# Altium schematic sheet S7CAS-PLEIADES-CARTE-MERE_P02_FPGA_B0B1.SchDoc
size Tabloid; DocumentNumber: 5; SheetNumber: 5; SheetTotal: 14; Size: 11x17; Sheet_Name: FPGA Bank0-1
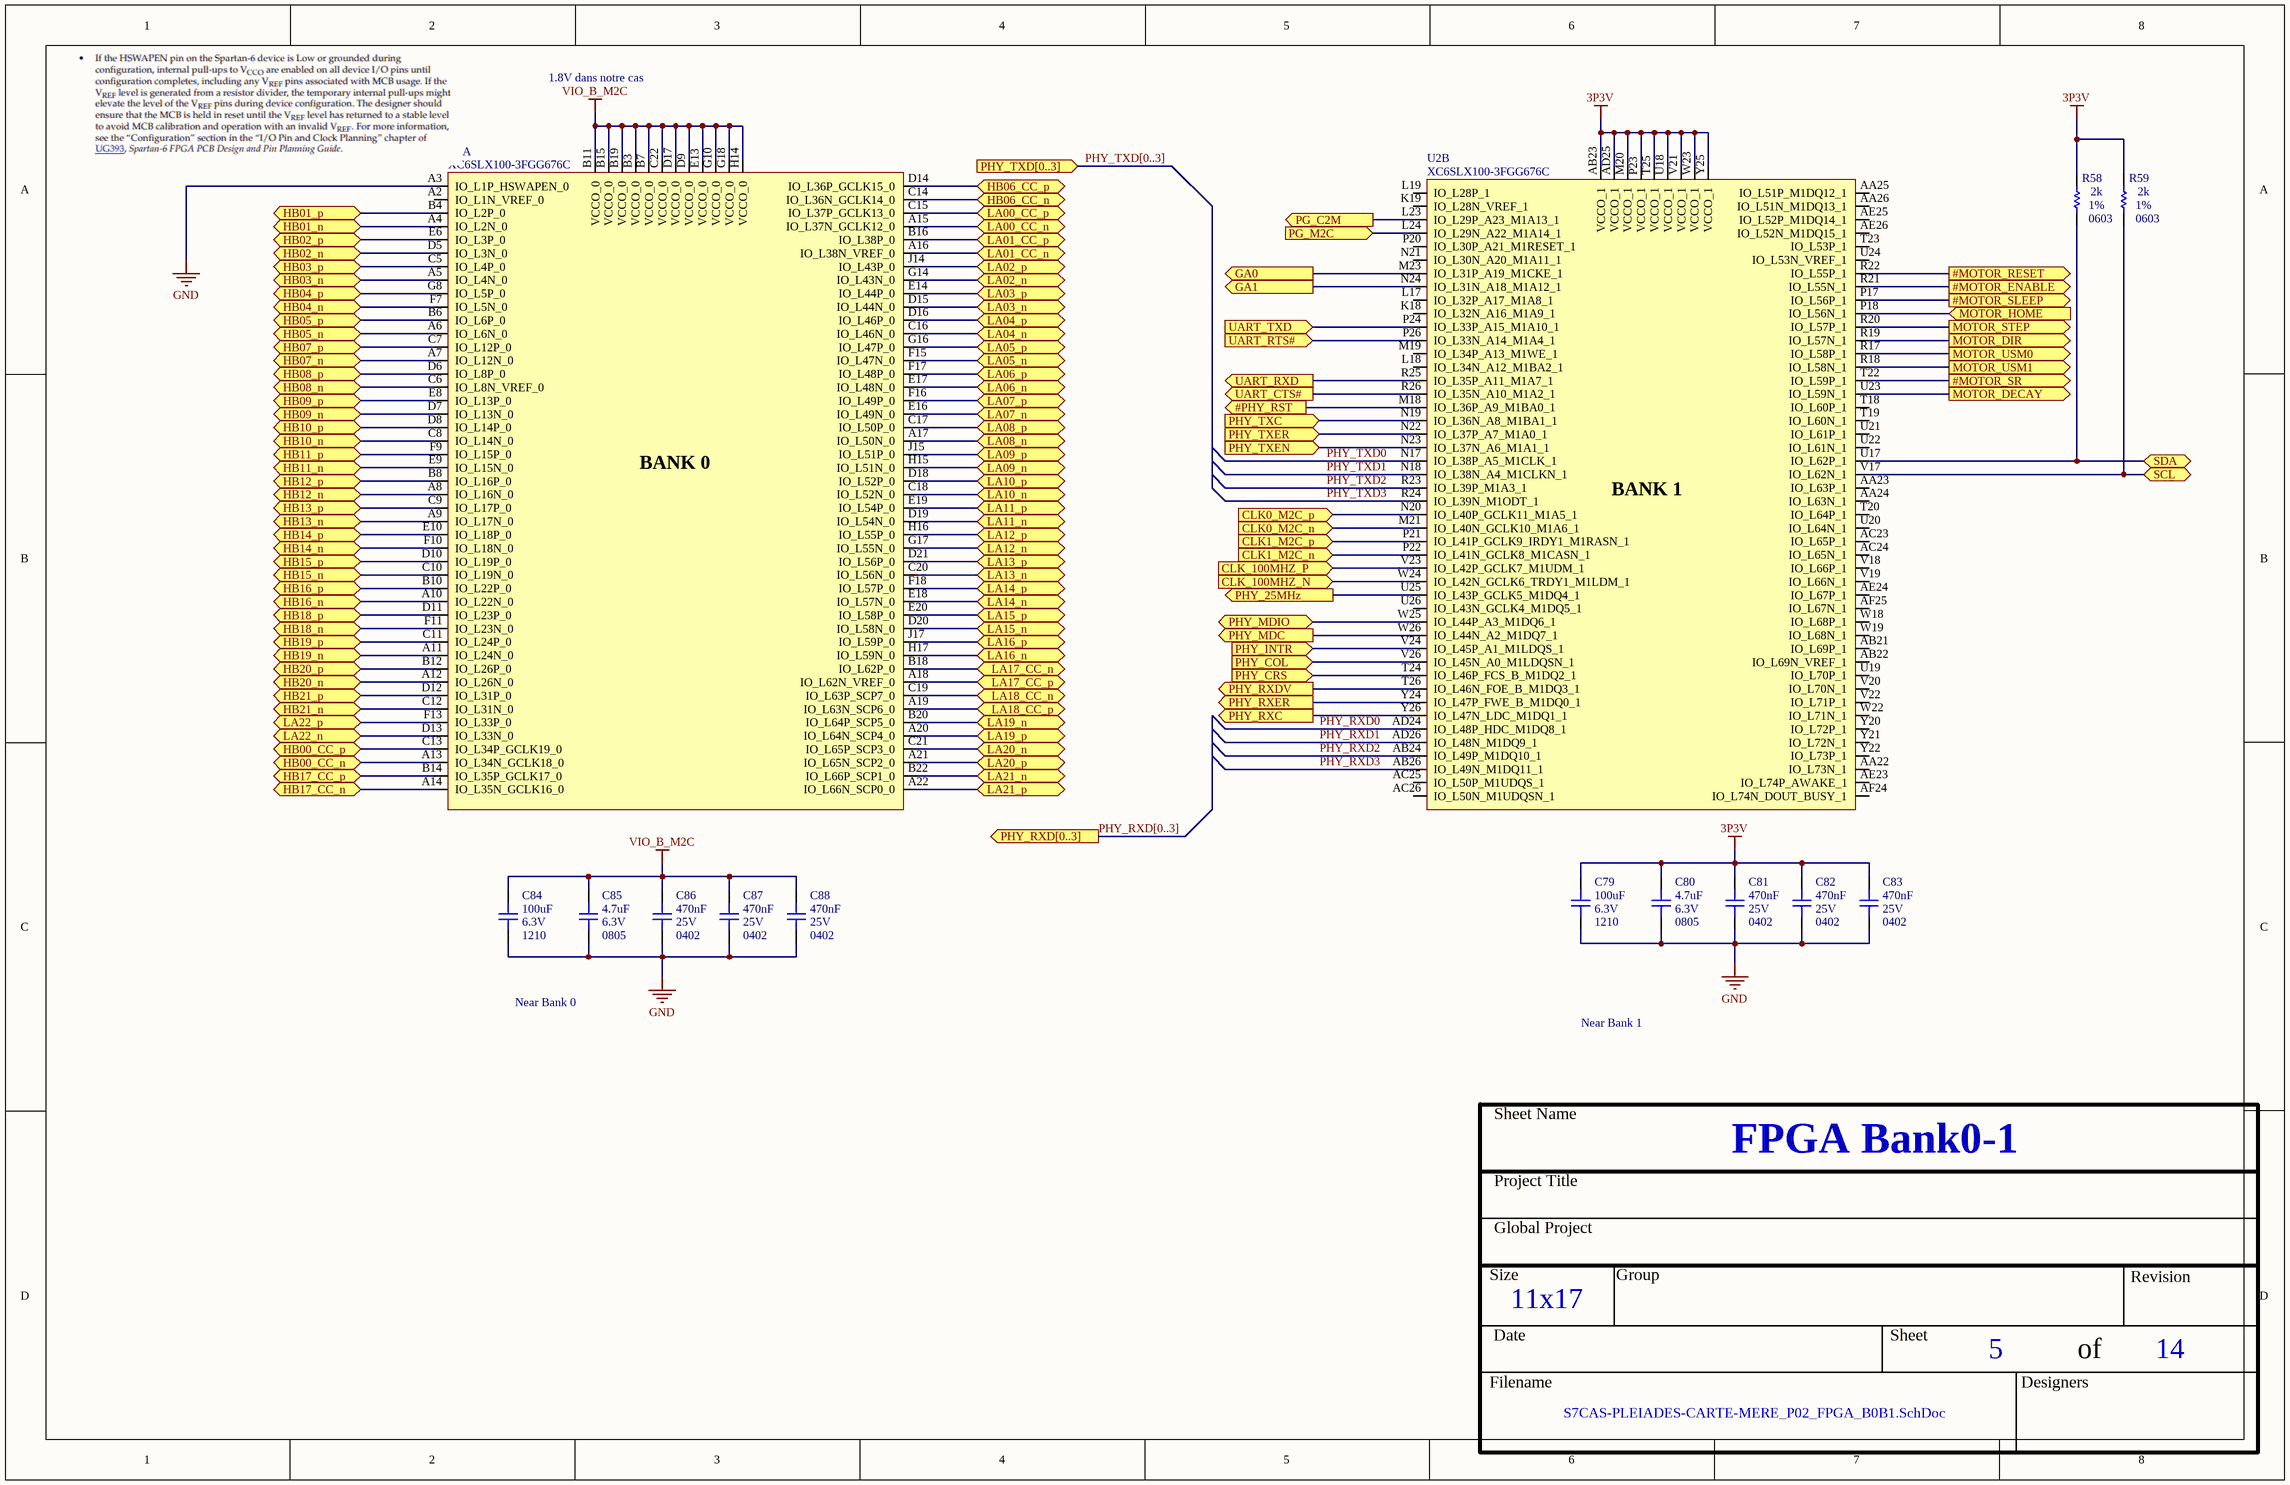
[diagram p0: S7CAS-PLEIADES-CARTE-MERE_P02_FPGA_B0B1.SchDoc]

## Parts
C79  value 100uF  Voltage: 6.3V  Package: 1210  [CAP_1210]  (hidden comment: CAP - 1210)
C80  value 4.7uF  Voltage: 6.3V  Package: 0805  [CAP_0805]  (hidden comment: CAP - 0805)
C81  value 470nF  Voltage: 25V  Package: 0402  [CAP_0402]  (hidden comment: CAP - 0402)
C82  value 470nF  Voltage: 25V  Package: 0402  [CAP_0402]  (hidden comment: CAP - 0402)
C83  value 470nF  Voltage: 25V  Package: 0402  [CAP_0402]  (hidden comment: CAP - 0402)
C84  value 100uF  Voltage: 6.3V  Package: 1210  [CAP_1210]  (hidden comment: CAP - 1210)
C85  value 4.7uF  Voltage: 6.3V  Package: 0805  [CAP_0805]  (hidden comment: CAP - 0805)
C86  value 470nF  Voltage: 25V  Package: 0402  [CAP_0402]  (hidden comment: CAP - 0402)
C87  value 470nF  Voltage: 25V  Package: 0402  [CAP_0402]  (hidden comment: CAP - 0402)
C88  value 470nF  Voltage: 25V  Package: 0402  [CAP_0402]  (hidden comment: CAP - 0402)
R58  value 2k  Package: 0603  Precision: 1%  [RES_0603]  (hidden comment: RES - 0603)
R59  value 2k  Package: 0603  Precision: 1%  [RES_0603]  (hidden comment: RES - 0603)
U2  XC6SLX100-3FGG676C  [FPGA_XILINX_FGG676]  (parts A,B of 10)

## Ports
#MOTOR_ENABLE (out), #MOTOR_RESET (out), #MOTOR_SLEEP (out), #MOTOR_SR (out), #PHY_RST (out), CLK0_M2C_n (in), CLK0_M2C_p (in), CLK1_M2C_n (in), CLK1_M2C_p (in), CLK_100MHZ_N (in), CLK_100MHZ_P (in), GA0 (out), GA1 (out), HB00_CC_n (bidir), HB00_CC_p (bidir), HB01_n (bidir), HB01_p (bidir), HB02_n (bidir), HB02_p (bidir), HB03_n (bidir), HB03_p (bidir), HB04_n (bidir), HB04_p (bidir), HB05_n (bidir), HB05_p (bidir), HB06_CC_n (bidir), HB06_CC_p (bidir), HB07_n (bidir), HB07_p (bidir), HB08_n (bidir), HB08_p (bidir), HB09_n (bidir), HB09_p (bidir), HB10_n (bidir), HB10_p (bidir), HB11_n (bidir), HB11_p (bidir), HB12_n (bidir), HB12_p (bidir), HB13_n (bidir), HB13_p (bidir), HB14_n (bidir), HB14_p (bidir), HB15_n (bidir), HB15_p (bidir), HB16_n (bidir), HB16_p (bidir), HB17_CC_n (bidir), HB17_CC_p (bidir), HB18_n (bidir), HB18_p (bidir), HB19_n (bidir), HB19_p (bidir), HB20_n (bidir), HB20_p (bidir), HB21_n (bidir), HB21_p (bidir), LA00_CC_n (bidir), LA00_CC_p (bidir), LA01_CC_n (bidir), LA01_CC_p (bidir), LA02_n (bidir), LA02_p (bidir), LA03_n (bidir), LA03_p (bidir), LA04_n (bidir), LA04_p (bidir), LA05_n (bidir), LA05_p (bidir), LA06_n (bidir), LA06_p (bidir), LA07_n (bidir), LA07_p (bidir), LA08_n (bidir), LA08_p (bidir), LA09_n (bidir), LA09_p (bidir), LA10_n (bidir), LA10_p (bidir), LA11_n (bidir), LA11_p (bidir), LA12_n (bidir), LA12_p (bidir), LA13_n (bidir), LA13_p (bidir), LA14_n (bidir), LA14_p (bidir), LA15_n (bidir), LA15_p (bidir), LA16_n (bidir), LA16_p (bidir), LA17_CC_n (bidir), LA17_CC_p (bidir), LA18_CC_n (bidir), LA18_CC_p (bidir), LA19_n (bidir), LA19_p (bidir), LA20_n (bidir), LA20_p (bidir), LA21_n (bidir), LA21_p (bidir), LA22_n (bidir), LA22_p (bidir), MOTOR_DECAY (out), MOTOR_DIR (out), MOTOR_HOME (in), MOTOR_STEP (out), MOTOR_USM0 (out), MOTOR_USM1 (out), PG_C2M (out), PG_M2C (in), PHY_25MHz (out), PHY_COL (in), PHY_CRS (in), PHY_INTR (in), PHY_MDC (out), PHY_MDIO (bidir), PHY_RXC (out), PHY_RXD[0..3] (out), PHY_RXDV (out), PHY_RXER (out), PHY_TXC (in), PHY_TXD[0..3] (in), PHY_TXEN (in), PHY_TXER (in), SCL (bidir), SDA (bidir), UART_CTS# (out), UART_RTS# (in), UART_RXD (out), UART_TXD (in)

## Nets
3P3V: C79.2 C80.2 C81.2 C82.2 C83.2 R58.2 R59.2 U2.AB23(VCCO_1) U2.AD25(VCCO_1) U2.M20(VCCO_1) U2.P23(VCCO_1) U2.T25(VCCO_1) U2.U18(VCCO_1) U2.V21(VCCO_1) U2.W23(VCCO_1) U2.Y25(VCCO_1)
GND: C79.1 C80.1 C81.1 C82.1 C83.1 C84.1 C85.1 C86.1 C87.1 C88.1 U2.A3(IO_L1P_HSWAPEN_0)
VIO_B_M2C: C84.2 C85.2 C86.2 C87.2 C88.2 U2.B3(VCCO_0) U2.B7(VCCO_0) U2.B11(VCCO_0) U2.B15(VCCO_0) U2.B19(VCCO_0) U2.C22(VCCO_0) U2.D9(VCCO_0) U2.D17(VCCO_0) U2.E13(VCCO_0) U2.G10(VCCO_0) U2.G18(VCCO_0) U2.H14(VCCO_0)
#MOTOR_ENABLE: U2.R21(IO_L55N_1) ; port #MOTOR_ENABLE
#MOTOR_RESET: U2.R22(IO_L55P_1) ; port #MOTOR_RESET
#MOTOR_SLEEP: U2.P17(IO_L56P_1) ; port #MOTOR_SLEEP
#MOTOR_SR: U2.T22(IO_L59P_1) ; port #MOTOR_SR
#PHY_RST: U2.M18(IO_L36P_A9_M1BA0_1) ; port #PHY_RST
CLK0_M2C_n: U2.M21(IO_L40N_GCLK10_M1A6_1) ; port CLK0_M2C_n
CLK0_M2C_p: U2.N20(IO_L40P_GCLK11_M1A5_1) ; port CLK0_M2C_p
CLK1_M2C_n: U2.P22(IO_L41N_GCLK8_M1CASN_1) ; port CLK1_M2C_n
CLK1_M2C_p: U2.P21(IO_L41P_GCLK9_IRDY1_M1RASN_1) ; port CLK1_M2C_p
CLK_100MHZ_N: U2.W24(IO_L42N_GCLK6_TRDY1_M1LDM_1) ; port CLK_100MHZ_N
CLK_100MHZ_P: U2.V23(IO_L42P_GCLK7_M1UDM_1) ; port CLK_100MHZ_P
GA0: U2.M23(IO_L31P_A19_M1CKE_1) ; port GA0
GA1: U2.N24(IO_L31N_A18_M1A12_1) ; port GA1
HB00_CC_n: U2.A13(IO_L34N_GCLK18_0) ; port HB00_CC_n
HB00_CC_p: U2.C13(IO_L34P_GCLK19_0) ; port HB00_CC_p
HB01_n: U2.A4(IO_L2N_0) ; port HB01_n
HB01_p: U2.B4(IO_L2P_0) ; port HB01_p
HB02_n: U2.D5(IO_L3N_0) ; port HB02_n
HB02_p: U2.E6(IO_L3P_0) ; port HB02_p
HB03_n: U2.A5(IO_L4N_0) ; port HB03_n
HB03_p: U2.C5(IO_L4P_0) ; port HB03_p
HB04_n: U2.F7(IO_L5N_0) ; port HB04_n
HB04_p: U2.G8(IO_L5P_0) ; port HB04_p
HB05_n: U2.A6(IO_L6N_0) ; port HB05_n
HB05_p: U2.B6(IO_L6P_0) ; port HB05_p
HB06_CC_n: U2.C14(IO_L36N_GCLK14_0) ; port HB06_CC_n
HB06_CC_p: U2.D14(IO_L36P_GCLK15_0) ; port HB06_CC_p
HB07_n: U2.A7(IO_L12N_0) ; port HB07_n
HB07_p: U2.C7(IO_L12P_0) ; port HB07_p
HB08_n: U2.C6(IO_L8N_VREF_0) ; port HB08_n
HB08_p: U2.D6(IO_L8P_0) ; port HB08_p
HB09_n: U2.D7(IO_L13N_0) ; port HB09_n
HB09_p: U2.E8(IO_L13P_0) ; port HB09_p
HB10_n: U2.C8(IO_L14N_0) ; port HB10_n
HB10_p: U2.D8(IO_L14P_0) ; port HB10_p
HB11_n: U2.E9(IO_L15N_0) ; port HB11_n
HB11_p: U2.F9(IO_L15P_0) ; port HB11_p
HB12_n: U2.A8(IO_L16N_0) ; port HB12_n
HB12_p: U2.B8(IO_L16P_0) ; port HB12_p
HB13_n: U2.A9(IO_L17N_0) ; port HB13_n
HB13_p: U2.C9(IO_L17P_0) ; port HB13_p
HB14_n: U2.F10(IO_L18N_0) ; port HB14_n
HB14_p: U2.E10(IO_L18P_0) ; port HB14_p
HB15_n: U2.C10(IO_L19N_0) ; port HB15_n
HB15_p: U2.D10(IO_L19P_0) ; port HB15_p
HB16_n: U2.A10(IO_L22N_0) ; port HB16_n
HB16_p: U2.B10(IO_L22P_0) ; port HB16_p
HB17_CC_n: U2.A14(IO_L35N_GCLK16_0) ; port HB17_CC_n
HB17_CC_p: U2.B14(IO_L35P_GCLK17_0) ; port HB17_CC_p
HB18_n: U2.F11(IO_L23N_0) ; port HB18_n
HB18_p: U2.D11(IO_L23P_0) ; port HB18_p
HB19_n: U2.A11(IO_L24N_0) ; port HB19_n
HB19_p: U2.C11(IO_L24P_0) ; port HB19_p
HB20_n: U2.A12(IO_L26N_0) ; port HB20_n
HB20_p: U2.B12(IO_L26P_0) ; port HB20_p
HB21_n: U2.C12(IO_L31N_0) ; port HB21_n
HB21_p: U2.D12(IO_L31P_0) ; port HB21_p
LA00_CC_n: U2.A15(IO_L37N_GCLK12_0) ; port LA00_CC_n
LA00_CC_p: U2.C15(IO_L37P_GCLK13_0) ; port LA00_CC_p
LA01_CC_n: U2.A16(IO_L38N_VREF_0) ; port LA01_CC_n
LA01_CC_p: U2.B16(IO_L38P_0) ; port LA01_CC_p
LA02_n: U2.G14(IO_L43N_0) ; port LA02_n
LA02_p: U2.J14(IO_L43P_0) ; port LA02_p
LA03_n: U2.D15(IO_L44N_0) ; port LA03_n
LA03_p: U2.E14(IO_L44P_0) ; port LA03_p
LA04_n: U2.C16(IO_L46N_0) ; port LA04_n
LA04_p: U2.D16(IO_L46P_0) ; port LA04_p
LA05_n: U2.F15(IO_L47N_0) ; port LA05_n
LA05_p: U2.G16(IO_L47P_0) ; port LA05_p
LA06_n: U2.E17(IO_L48N_0) ; port LA06_n
LA06_p: U2.F17(IO_L48P_0) ; port LA06_p
LA07_n: U2.E16(IO_L49N_0) ; port LA07_n
LA07_p: U2.F16(IO_L49P_0) ; port LA07_p
LA08_n: U2.A17(IO_L50N_0) ; port LA08_n
LA08_p: U2.C17(IO_L50P_0) ; port LA08_p
LA09_n: U2.H15(IO_L51N_0) ; port LA09_n
LA09_p: U2.J15(IO_L51P_0) ; port LA09_p
LA10_n: U2.C18(IO_L52N_0) ; port LA10_n
LA10_p: U2.D18(IO_L52P_0) ; port LA10_p
LA11_n: U2.D19(IO_L54N_0) ; port LA11_n
LA11_p: U2.E19(IO_L54P_0) ; port LA11_p
LA12_n: U2.G17(IO_L55N_0) ; port LA12_n
LA12_p: U2.H16(IO_L55P_0) ; port LA12_p
LA13_n: U2.C20(IO_L56N_0) ; port LA13_n
LA13_p: U2.D21(IO_L56P_0) ; port LA13_p
LA14_n: U2.E18(IO_L57N_0) ; port LA14_n
LA14_p: U2.F18(IO_L57P_0) ; port LA14_p
LA15_n: U2.D20(IO_L58N_0) ; port LA15_n
LA15_p: U2.E20(IO_L58P_0) ; port LA15_p
LA16_n: U2.H17(IO_L59N_0) ; port LA16_n
LA16_p: U2.J17(IO_L59P_0) ; port LA16_p
LA17_CC_n: U2.B18(IO_L62P_0) ; port LA17_CC_n
LA17_CC_p: U2.A18(IO_L62N_VREF_0) ; port LA17_CC_p
LA18_CC_n: U2.C19(IO_L63P_SCP7_0) ; port LA18_CC_n
LA18_CC_p: U2.A19(IO_L63N_SCP6_0) ; port LA18_CC_p
LA19_n: U2.B20(IO_L64P_SCP5_0) ; port LA19_n
LA19_p: U2.A20(IO_L64N_SCP4_0) ; port LA19_p
LA20_n: U2.C21(IO_L65P_SCP3_0) ; port LA20_n
LA20_p: U2.A21(IO_L65N_SCP2_0) ; port LA20_p
LA21_n: U2.B22(IO_L66P_SCP1_0) ; port LA21_n
LA21_p: U2.A22(IO_L66N_SCP0_0) ; port LA21_p
LA22_n: U2.D13(IO_L33N_0) ; port LA22_n
LA22_p: U2.F13(IO_L33P_0) ; port LA22_p
MOTOR_DECAY: U2.U23(IO_L59N_1) ; port MOTOR_DECAY
MOTOR_DIR: U2.R19(IO_L57N_1) ; port MOTOR_DIR
MOTOR_HOME: U2.P18(IO_L56N_1) ; port MOTOR_HOME
MOTOR_STEP: U2.R20(IO_L57P_1) ; port MOTOR_STEP
MOTOR_USM0: U2.R17(IO_L58P_1) ; port MOTOR_USM0
MOTOR_USM1: U2.R18(IO_L58N_1) ; port MOTOR_USM1
PG_C2M: U2.L23(IO_L29P_A23_M1A13_1) ; port PG_C2M
PG_M2C: U2.L24(IO_L29N_A22_M1A14_1) ; port PG_M2C
PHY_25MHz: U2.U25(IO_L43P_GCLK5_M1DQ4_1) ; port PHY_25MHz
PHY_COL: U2.V26(IO_L45N_A0_M1LDQSN_1) ; port PHY_COL
PHY_CRS: U2.T24(IO_L46P_FCS_B_M1DQ2_1) ; port PHY_CRS
PHY_INTR: U2.V24(IO_L45P_A1_M1LDQS_1) ; port PHY_INTR
PHY_MDC: U2.W26(IO_L44N_A2_M1DQ7_1) ; port PHY_MDC
PHY_MDIO: U2.W25(IO_L44P_A3_M1DQ6_1) ; port PHY_MDIO
PHY_RXC: U2.Y26(IO_L47N_LDC_M1DQ1_1) ; port PHY_RXC
PHY_RXD0: U2.AD24(IO_L48P_HDC_M1DQ8_1)
PHY_RXD1: U2.AD26(IO_L48N_M1DQ9_1)
PHY_RXD2: U2.AB24(IO_L49P_M1DQ10_1)
PHY_RXD3: U2.AB26(IO_L49N_M1DQ11_1)
PHY_RXDV: U2.T26(IO_L46N_FOE_B_M1DQ3_1) ; port PHY_RXDV
PHY_RXER: U2.Y24(IO_L47P_FWE_B_M1DQ0_1) ; port PHY_RXER
PHY_TXC: U2.N19(IO_L36N_A8_M1BA1_1) ; port PHY_TXC
PHY_TXD0: U2.N17(IO_L38P_A5_M1CLK_1)
PHY_TXD1: U2.N18(IO_L38N_A4_M1CLKN_1)
PHY_TXD2: U2.R23(IO_L39P_M1A3_1)
PHY_TXD3: U2.R24(IO_L39N_M1ODT_1)
PHY_TXEN: U2.N23(IO_L37N_A6_M1A1_1) ; port PHY_TXEN
PHY_TXER: U2.N22(IO_L37P_A7_M1A0_1) ; port PHY_TXER
SCL: R59.1 U2.V17(IO_L62N_1) ; port SCL
SDA: R58.1 U2.U17(IO_L62P_1) ; port SDA
UART_CTS#: U2.R26(IO_L35N_A10_M1A2_1) ; port UART_CTS#
UART_RTS#: U2.P26(IO_L33N_A14_M1A4_1) ; port UART_RTS#
UART_RXD: U2.R25(IO_L35P_A11_M1A7_1) ; port UART_RXD
UART_TXD: U2.P24(IO_L33P_A15_M1A10_1) ; port UART_TXD

Not connected (* = marked no-connect by the designer): U2 A2(IO_L1N_VREF_0) AA22(IO_L73N_1) AA23(IO_L63P_1) AA24(IO_L63N_1) AA25(IO_L51P_M1DQ12_1) AA26(IO_L51N_M1DQ13_1) AB21(IO_L69P_1) AB22(IO_L69N_VREF_1) AC23(IO_L65P_1) AC24(IO_L65N_1) AC25(IO_L50P_M1UDQS_1) AC26(IO_L50N_M1UDQSN_1) AE23(IO_L74P_AWAKE_1) AE24(IO_L67P_1) AE25(IO_L52P_M1DQ14_1) AE26(IO_L52N_M1DQ15_1) AF24(IO_L74N_DOUT_BUSY_1) AF25(IO_L67N_1) K18(IO_L32N_A16_M1A9_1) K19(IO_L28N_VREF_1) L17(IO_L32P_A17_M1A8_1) L18(IO_L34N_A12_M1BA2_1) L19(IO_L28P_1) M19(IO_L34P_A13_M1WE_1) N21(IO_L30N_A20_M1A11_1) P20(IO_L30P_A21_M1RESET_1) T18(IO_L60P_1) T19(IO_L60N_1) T20(IO_L64P_1) T23(IO_L53P_1) U19(IO_L70P_1) U20(IO_L64N_1) U21(IO_L61P_1) U22(IO_L61N_1) U24(IO_L53N_VREF_1) U26(IO_L43N_GCLK4_M1DQ5_1) V18(IO_L66P_1) V19(IO_L66N_1) V20(IO_L70N_1) V22(IO_L71P_1) W18(IO_L68P_1) W19(IO_L68N_1) W22(IO_L71N_1) Y20(IO_L72P_1) Y21(IO_L72N_1) Y22(IO_L73P_1)

## Buses and harness runs
bus PHY_RXD[0..3] = port PHY_RXD[0..3]
bus PHY_TXD[0..3] = port PHY_TXD[0..3]

## Notes on the sheet
- 1.8V dans notre cas
- Near Bank 0
- Near Bank 1
- Sheet Name
- Project Title
- Global Project
- Size
- Group
- Revision
- Date
- Sheet
- of
- Filename
- Designers
- (in symbol FPGA_XC6SLX100-3FGG676C, part A) BANK 0
- (in symbol FPGA_XC6SLX100-3FGG676C, part B) BANK 1

## Library data of the parts
C79 C84 = CAP - 1210: Precision: 10%; Current: *; CreatedBy: Jonathan Bouchard; Power: *
C80 C85 = CAP - 0805: Precision: 10%; Current: *; CreatedBy: Jonathan Bouchard; Power: *
C81-C83 C86-C88 = CAP - 0402: Precision: 10%; Current: *; CreatedBy: Jonathan Bouchard; Power: *
U2 = FPGA_XC6SLX100-3FGG676C: FPGA - XILINX SPARTAN 6 480 I/O - BGA-676; Voltage: 1.14 V ~ 1.26 V; Current: *; Power: *; Mfg: Xilinx; Mfg Part Number: XC6SLX100-3FGG676C; HelpURL: https://www.xilinx.com/support/documentation/data_sheets/ds162.pdf; CreatedBy: Jonathan Bouchard; Temperature: 0°C ~ 85°C (TJ); Value: *; Precision: *; Package: BGA-676; Supplier 1: Digikey; Supplier Part Number 1: 122-1760-ND
R58 R59 = RES - 0603: Current: *; CreatedBy: Jonathan Bouchard